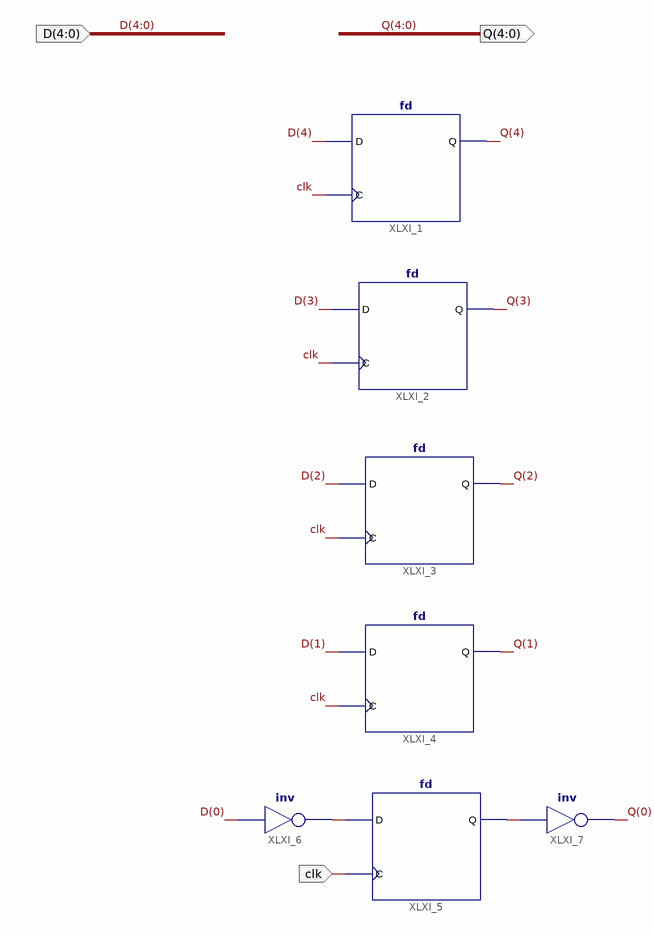
[diagram p0: schematic sheet 1]
// Xilinx ISE schematic ff5.sch (spartan3e) as structural Verilog: 7 symbols, 3 ports
module ff5 (
  input  clk,
  input  [4:0] D,
  output [4:0] Q
);

  wire XLXN_10, XLXN_15;

  fd XLXI_1 (.C(clk), .D(D[4]), .Q(Q[4]));
  fd XLXI_2 (.C(clk), .D(D[3]), .Q(Q[3]));
  fd XLXI_3 (.C(clk), .D(D[2]), .Q(Q[2]));
  fd XLXI_4 (.C(clk), .D(D[1]), .Q(Q[1]));
  fd XLXI_5 (.C(clk), .D(XLXN_10), .Q(XLXN_15));
  not XLXI_6 (XLXN_10, D[0]);
  not XLXI_7 (Q[0], XLXN_15);
endmodule
